# Altium schematic sheet warship_demo_3.SchDoc
size A4
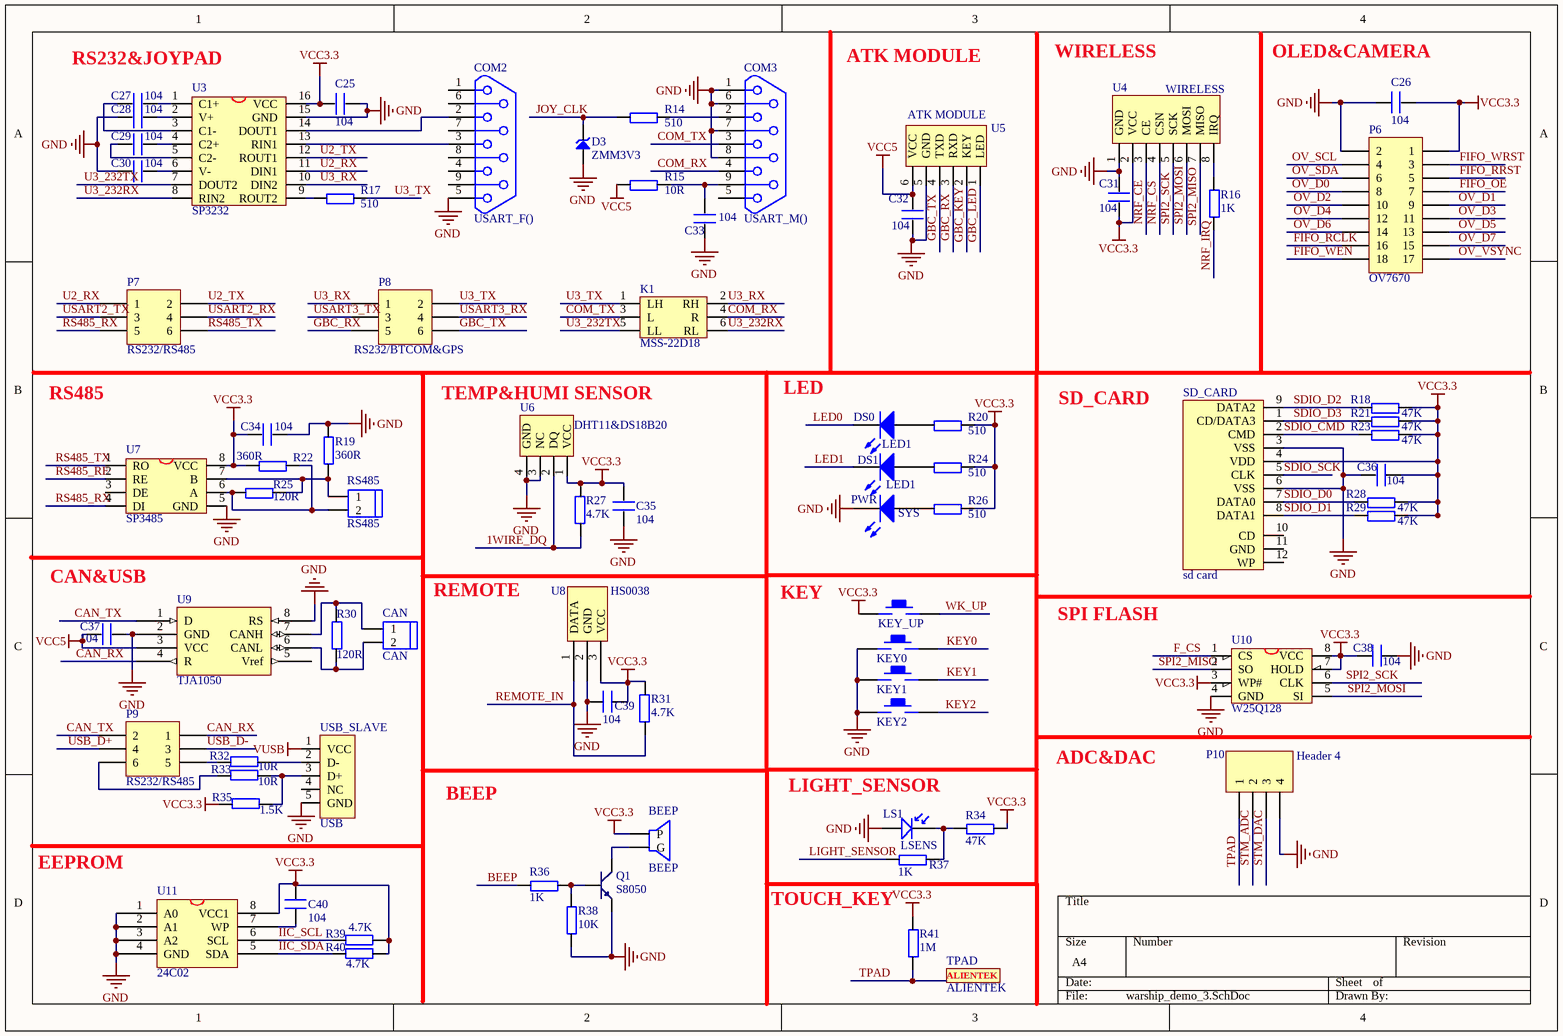
[diagram p0: warship_demo_3.SchDoc]

## Parts
BEEP  BEEP  [BELL-5]
C25  104  [0603P]
C26  104  [0603P]
C27  104  [0603P]
C28  104  [0603P]
C29  104  [0603P]
C30  104  [0603P]
C31  104  [0603P]
C32  104  [0603P]
C33  104  [0603P]
C34  104  [0603P]
C35  104  [0603P]
C36  104  [0603P]
C37  104  [0603P]
C38  104  [0603P]
C39  104  [0603P]
C40  104  [0603P]
CAN  CAN  [HEAD2L-0.8]
COM2  USART_F()  [DB9]
COM3  USART_M()  [DB9]
D3  ZMM3V3  [DIODE_ZMMx]
DS0  LED1  [SMDLED]
DS1  LED1  [SMDLED]
K1  MSS-22D18  [MSS-22D18-DIP]
KEY0  KEY_UP  [KEY_M]  (value not drawn)
KEY1  KEY_UP  [KEY_M]  (value not drawn)
KEY2  KEY_UP  [KEY_M]  (value not drawn)
KEY_UP  KEY_UP  [KEY_M]  (value not drawn)
LS1  LSENS  [SMDLED]
P6  OV7670  [HDR2X9]
P7  RS232/RS485  [HDR2X3]
P8  RS232/BTCOM&GPS  [HDR2X3]
P9  RS232/RS485  [HDR2X3]
P10  Header 4  [HDR1X4]
PWR  SYS  [SMDLED]
Q1  S8050  [SOT-23R]
R14  510  [0603P]
R15  10R  [0603P]
R16  1K  [0603P]
R17  510  [0603P]
R18  47K  [0603P]
R19  360R  [0603P]
R20  510  [0603P]
R21  47K  [0603P]
R22  360R  [0603P]
R23  47K  [0603P]
R24  510  [0603P]
R25  120R  [0603P]
R26  510  [0603P]
R27  4.7K  [0603P]
R28  47K  [0603P]
R29  47K  [0603P]
R30  120R  [0603P]
R31  4.7K  [0603P]
R32  10R  [0603P]
R33  10R  [0603P]
R34  47K  [0603P]
R35  1.5K  [0603P]
R36  1K  [0603P]
R37  1K  [0603P]
R38  10K  [0603P]
R39  4.7K  [0603P]
R40  4.7K  [0603P]
R41  1M  [0603P]
RS485  RS485  [HEAD2L-0.8]
SD_CARD  sd card  [SDCARD_L]
TPAD  ALIENTEK  [ALIENTEK_PAD1]
U3  SP3232  [SOP16M]
U4  WIRELESS  [NRF24L01]
U5  ATK MODULE  [HEAD6]
U6  DHT11&DS18B20  [DHT11]
U7  SP3485  [SOP-8]
U8  HS0038  [HS0038]
U9  TJA1050  [SOP-8]
U10  W25Q128  [SOIC-8]
U11  24C02  [SOP-8]
USB_SLAVE  USB  [USB/SM0.8-6H5]

## Nets
GND: C25.1 C26.2 C28.2 C30.2 C31.2 C32.1 C33.2 C34.1 C35.2 C36.2 C37.1 C38.1 C39.1 COM2.5 COM3.1 COM3.6 COM3.7 COM3.8 D3.1 KEY0.1 KEY1.1 KEY2.1 LS1.1 P6.2 P10.4 PWR.2(K) Q1.1(E) R19.2 R38.1 SD_CARD.3(VSS) SD_CARD.6(VSS) U3.15(GND) U4.1(GND) U5.5(GND) U6.3(NC) U6.4(GND) U7.5(GND) U8.2(GND) U9.2(GND) U9.8(RS) U10.4(GND) U11.1(A0) U11.2(A1) U11.3(A2) U11.4(GND) USB_SLAVE.5(GND)
VCC3.3: BEEP.1(P) C25.2 C26.1 C31.1 C34.2 C35.1 C36.1 C38.2 C39.2 C40.1 KEY_UP.1 P6.1 R18.2 R20.2 R21.2 R22.1 R23.2 R24.2 R26.2 R27.1 R28.2 R29.2 R31.1 R34.2 R35.2 R39.1 R40.1 R41.2 SD_CARD.4(VDD) U3.16(VCC) U4.2(VCC) U6.1(VCC) U7.8(VCC) U8.3(VCC) U10.3(WP#) U10.7(HOLD) U10.8(VCC) U11.8(VCC1)
VCC5: C32.2 C37.2 R15.1 U5.6(VCC) U9.3(VCC)
VUSB: USB_SLAVE.1(VCC)
1WIRE_DQ: R27.2 U6.2(DQ)
BEEP: R36.1
CAN_RX: P9.1 U9.4(R)
CAN_TX: P9.2 U9.1(D)
COM_RX: COM3.4 K1.4(R)
COM_TX: COM3.3 K1.3(L)
F_CS: U10.1(CS)
FIFO_OE: P6.7
FIFO_RCLK: P6.16
FIFO_RRST: P6.5
FIFO_WEN: P6.18
FIFO_WRST: P6.3
GBC_KEY: U5.2(KEY)
GBC_LED: U5.1(LED)
GBC_RX: P8.5 U5.3(RXD)
GBC_TX: P8.6 U5.4(TXD)
IIC_SCL: R39.2 U11.6(SCL)
IIC_SDA: R40.2 U11.5(SDA)
JOY_CLK: D3.2 R14.1
KEY0: KEY0.2
KEY1: KEY1.2
KEY2: KEY2.2
LED0: DS0.2(K)
LED1: DS1.2(K)
LIGHT_SENSOR: R37.1
NRF_CE: U4.3(CE)
NRF_CS: U4.4(CSN)
NRF_IRQ: R16.1
OV_D0: P6.8
OV_D1: P6.9
OV_D2: P6.10
OV_D3: P6.11
OV_D4: P6.12
OV_D5: P6.13
OV_D6: P6.14
OV_D7: P6.15
OV_SCL: P6.4
OV_SDA: P6.6
OV_VSYNC: P6.17
REMOTE_IN: R31.2 U8.1(DATA)
RS485_RE: U7.2(RE)
RS485_RX: P7.5 U7.4(DI)
RS485_TX: P7.6 U7.1(RO)
SDIO_CMD: R23.1 SD_CARD.2(CMD)
SDIO_D0: R28.1 SD_CARD.7(DATA0)
SDIO_D1: R29.1 SD_CARD.8(DATA1)
SDIO_D2: R18.1 SD_CARD.9(DATA2)
SDIO_D3: R21.1 SD_CARD.1(CD/DATA3)
SDIO_SCK: SD_CARD.5(CLK)
SPI2_MISO: U4.7(MISO) U10.2(SO)
SPI2_MOSI: U4.6(MOSI) U10.5(SI)
SPI2_SCK: U4.5(SCK) U10.6(CLK)
STM_ADC: P10.2
STM_DAC: P10.3
TPAD: P10.1 R41.1
U2_RX: P7.1 U3.11(DIN1)
U2_TX: P7.2 U3.12(ROUT1)
U3_232RX: K1.6(RL) U3.8(RIN2)
U3_232TX: K1.5(LL) U3.7(DOUT2)
U3_RX: K1.2(RH) P8.1 U3.10(DIN2)
U3_TX: K1.1(LH) P8.2 R17.2
USART2_RX: P7.4
USART2_TX: P7.3
USART3_RX: P8.4
USART3_TX: P8.3
USB_D+: P9.4
USB_D-: P9.3
WK_UP: KEY_UP.2
NetBEEP_2: BEEP.2(G) Q1.3(C)
NetC27_1: C27.1 U3.1(C1+)
NetC27_2: C27.2 U3.3(C1-)
NetC28_1: C28.1 U3.2(V+)
NetC29_1: C29.1 U3.4(C2+)
NetC29_2: C29.2 U3.5(C2-)
NetC30_1: C30.1 U3.6(V-)
NetC33_1: C33.1 COM3.9 R15.2
NetC40_2: C40.2 U11.7(WP)
NetCAN_1: CAN.1 R30.2 U9.7(CANH)
NetCAN_2: CAN.2 R30.1 U9.6(CANL)
NetCOM2_2: COM2.2 U3.14(DOUT1)
NetCOM2_3: COM2.3 U3.13(RIN1)
NetCOM3_2: COM3.2 R14.2
NetDS0_1: DS0.1(A) R20.1
NetDS1_1: DS1.1(A) R24.1
NetLS1_2: LS1.2 R34.1 R37.2
NetP9_5: P9.5 R32.2
NetP9_6: P9.6 R33.2
NetPWR_1: PWR.1(A) R26.1
NetQ1_2: Q1.2(B) R36.2 R38.2
NetR16_2: R16.2 U4.8(IRQ)
NetR17_1: R17.1 U3.9(ROUT2)
NetR19_1: R19.1 R25.2 RS485.1 U7.7(B)
NetR22_2: R22.2 R25.1 RS485.2 U7.6(A)
NetR32_1: R32.1 USB_SLAVE.2(D-)
NetR33_1: R33.1 R35.1 USB_SLAVE.3(D+)

Not connected (* = marked no-connect by the designer): COM2 1 4 6 7 8 9; COM3 5; SD_CARD 10(CD) 11(GND) 12(WP); U7 3(DE); U9 5(Vref); USB_SLAVE 4(NC)

## Notes on the sheet
- RS232&JOYPAD
- ATK MODULE
- WIRELESS
- (near C26) OLED&CAMERA
- RS485
- TEMP&HUMI SENSOR
- LED
- SD_CARD
- CAN&USB
- REMOTE
- KEY
- SPI FLASH
- ADC&DAC
- BEEP
- (near LS1) LIGHT_SENSOR
- EEPROM
- TOUCH_KEY

## Library data of the parts
C25-C40 = C
CAN RS485 = HEAD2
COM2 COM3 = DB9
D3 = ZMM3V6
DS0 DS1 PWR = LED2: Typical RED, GREEN, YELLOW, AMBER GaAs LED; Published: 8-Jun-2000; LatestRevisionDate: 17-Jul-2002; LatestRevisionNote: Re-released for DXP Platform.; PackageDocument: Feb-2002; PackageReference: 3.2X1.6X1.1; Publisher: Altium Limited
K1 = MSS-22D18: 六脚波动开关
KEY0-KEY2 KEY_UP = KEY_M
LS1 = LSENS: LIGHT SENS
P6 = Header 9X2: Header, 9-Pin, Dual row; LatestRevisionDate: 17-Jul-2002; LatestRevisionNote: Re-released for DXP Platform.; Publisher: Altium Limited
P7-P9 = Header 3X2: Header, 3-Pin, Dual row; LatestRevisionDate: 17-Jul-2002; LatestRevisionNote: Re-released for DXP Platform.; Publisher: Altium Limited
P10 = Header 4: Header, 4-Pin; LatestRevisionDate: 17-Jul-2002; LatestRevisionNote: Re-released for DXP Platform.; Publisher: Altium Limited
Q1 = NPN: 8050/BCW846/BCW847
R14-R41 = R
U3 = MAX3232
U4 = NRF24L01
U5 = ATK-HC05
U6 = DHT11: 数字温湿度传感器
U7 = MAX3485
U9 = SN65HVD230D
U10 = W25X16: W25X16;SST25VF016;MX25L1605
U11 = 24C256
USB_SLAVE = USB5